# Altium schematic sheet Main.SchDoc
size A3; SheetNumber: 1; SheetTotal: 13
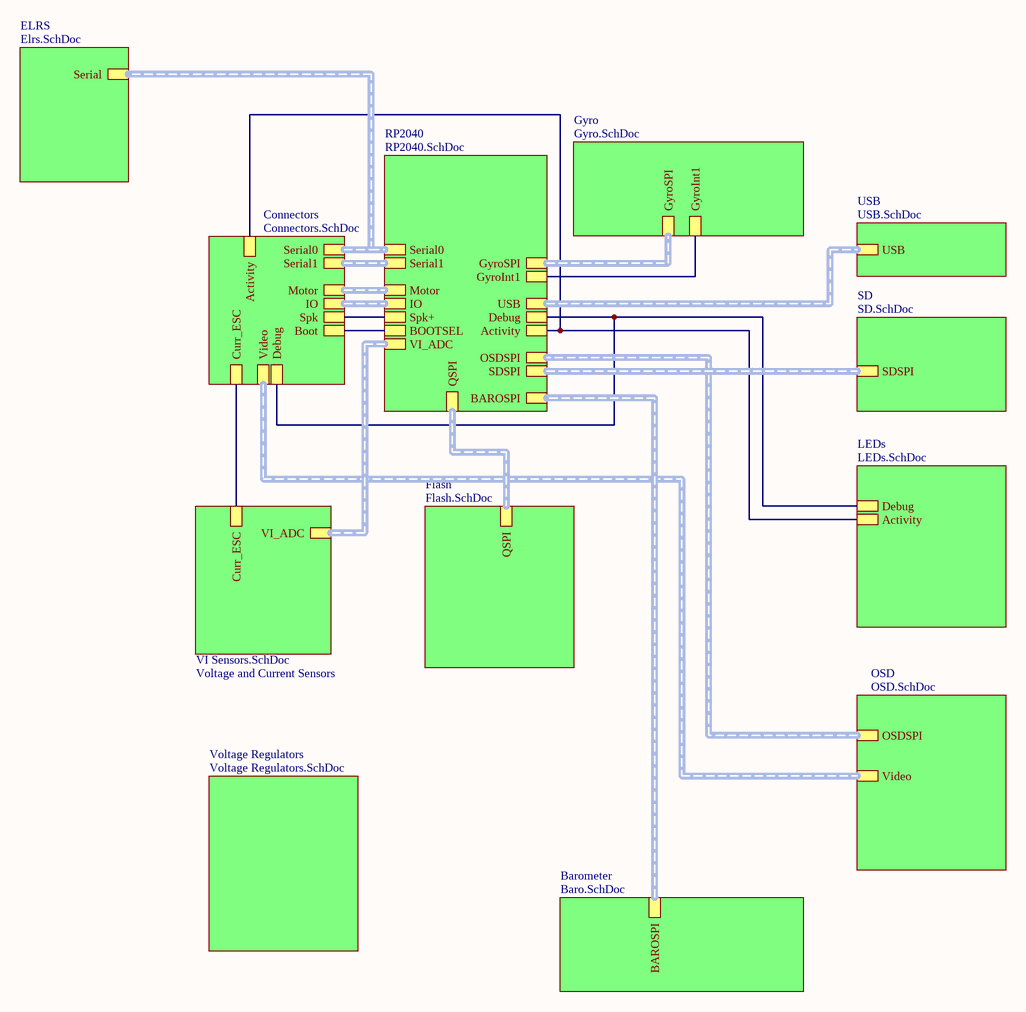
[diagram p0: Main.SchDoc]

## Sub-sheets
Barometer = Baro.SchDoc: BAROSPI (harness SPI)
Connectors = Connectors.SchDoc: Serial1 (harness UART), Motor (harness Motor), Serial0 (harness UART), Curr_ESC, IO (harness IO), Video (harness Video), Spk, Debug, Activity, Boot
ELRS = Elrs.SchDoc: Serial (harness UART)
Flash = Flash.SchDoc: QSPI (harness QSPI)
Gyro = Gyro.SchDoc: GyroSPI (harness SPI), GyroInt1
LEDs = LEDs.SchDoc: Debug, Activity
OSD = OSD.SchDoc: OSDSPI (harness SPI), Video (harness Video)
RP2040 = RP2040.SchDoc: QSPI (harness QSPI), USB (harness USB), Debug, Activity, BAROSPI (harness SPI), OSDSPI (harness SPI), GyroSPI (harness SPI), GyroInt1, Serial1 (harness UART), Motor (harness Motor), Serial0 (harness UART), VI_ADC (harness VI), IO (harness IO), Spk+, BOOTSEL, SDSPI (harness SPI)
SD = SD.SchDoc: SDSPI (harness SPI)
USB = USB.SchDoc: USB (harness USB)
Voltage and Current Sensors = VI Sensors.SchDoc: Curr_ESC, VI_ADC (harness VI)
Voltage Regulators = Voltage Regulators.SchDoc: no entries

## Nets
(unnamed): sheet RP2040/Debug, sheet LEDs/Debug, sheet Connectors/Debug
(unnamed): sheet RP2040/Activity, sheet LEDs/Activity, sheet Connectors/Activity
(unnamed): sheet RP2040/GyroInt1, sheet Gyro/GyroInt1
(unnamed): sheet RP2040/Spk+, sheet Connectors/Spk
(unnamed): sheet RP2040/BOOTSEL, sheet Connectors/Boot
(unnamed): sheet Connectors/Curr_ESC, sheet Voltage and Current Sensors/Curr_ESC

## Buses and harness runs
harness sheet Barometer/BAROSPI = sheet RP2040/BAROSPI
harness sheet Connectors/IO = sheet RP2040/IO
harness sheet Connectors/Motor = sheet RP2040/Motor
harness sheet Connectors/Serial0 = sheet ELRS/Serial = sheet RP2040/Serial0
harness sheet Connectors/Serial1 = sheet RP2040/Serial1
harness sheet Connectors/Video = sheet OSD/Video
harness sheet Flash/QSPI = sheet RP2040/QSPI
harness sheet Gyro/GyroSPI = sheet RP2040/GyroSPI
harness sheet OSD/OSDSPI = sheet RP2040/OSDSPI
harness sheet RP2040/SDSPI = sheet SD/SDSPI
harness sheet RP2040/USB = sheet USB/USB
harness sheet RP2040/VI_ADC = sheet Voltage and Current Sensors/VI_ADC